# Altium schematic sheet stc15.SchDoc
size A4; SheetNumber: 1; SheetTotal: 1
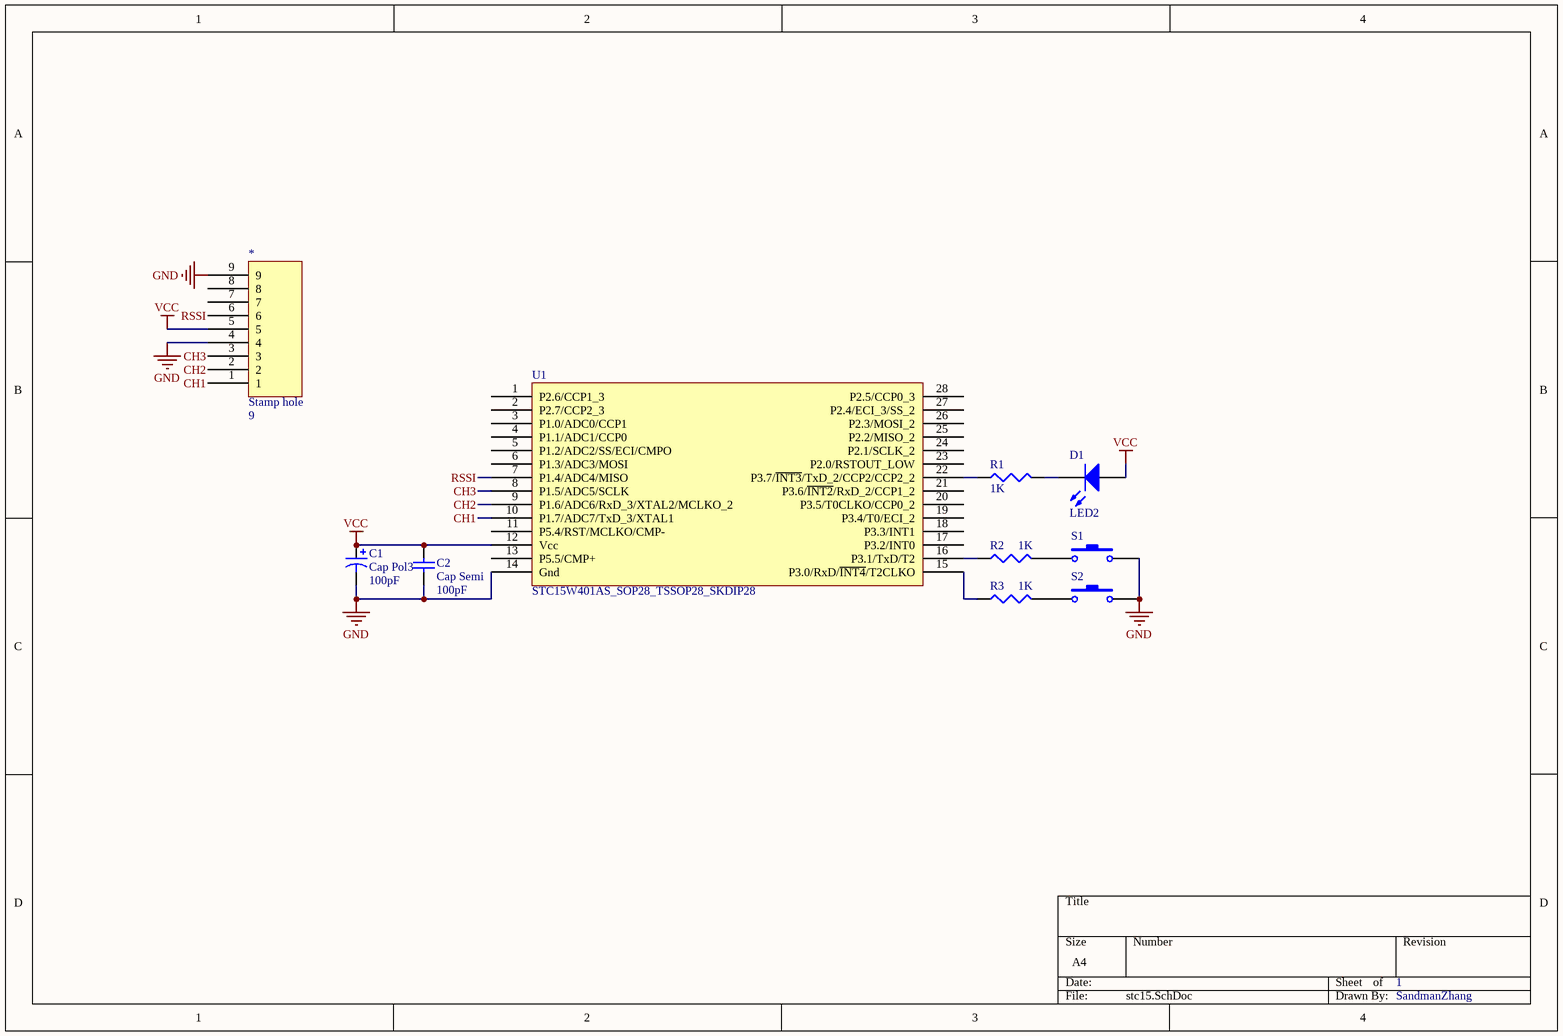
[diagram p0: stc15.SchDoc]

## Parts
*  9  [9]
C1  Cap Pol3  value 100pF  [C0805]
C2  Cap Semi  value 100pF  [1608[0603]]
D1  LED2  [6-0805_N]
R1  value 1K  [J1-0603]  (hidden comment: Res3)
R2  value 1K  [J1-0603]  (hidden comment: Res3)
R3  value 1K  [J1-0603]  (hidden comment: Res3)
S1  SW-PB  [SPST-2]  (value not drawn)
S2  SW-PB  [SPST-2]  (value not drawn)
U1  STC15W401AS_SOP28_TSSOP28_SKDIP28  [SOP28]

## Nets
GND: *.4 *.9 C1.2 C2.1 S1.2 S2.2 U1.14(Gnd)
VCC: *.5 C1.1 C2.2 D1.1(A) U1.12(Vcc)
CH1: *.1 U1.10(P1.7/ADC7/TxD_3/XTAL1)
CH2: *.2 U1.9(P1.6/ADC6/RxD_3/XTAL2/MCLKO_2)
CH3: *.3 U1.8(P1.5/ADC5/SCLK)
RSSI: *.6 U1.7(P1.4/ADC4/MISO)
NetD1_2: D1.2(K) R1.2
NetR1_1: R1.1 U1.22(P3.7/~{INT3}/TxD_2/CCP2/CCP2_2)
NetR2_1: R2.1 U1.16(P3.1/TxD/T2)
NetR2_2: R2.2 S1.1
NetR3_1: R3.1 U1.15(P3.0/RxD/~{INT4}/T2CLKO)
NetR3_2: R3.2 S2.1

Not connected (* = marked no-connect by the designer): * 7 8; U1 1(P2.6/CCP1_3) 2(P2.7/CCP2_3) 3(P1.0/ADC0/CCP1) 4(P1.1/ADC1/CCP0) 5(P1.2/ADC2/SS/ECI/CMPO) 6(P1.3/ADC3/MOSI) 11(P5.4/RST/MCLKO/CMP-) 13(P5.5/CMP+) 17(P3.2/INT0) 18(P3.3/INT1) 19(P3.4/T0/ECI_2) 20(P3.5/T0CLKO/CCP0_2) 21(P3.6/~{INT2}/RxD_2/CCP1_2) 23(P2.0/RSTOUT_LOW) 24(P2.1/SCLK_2) 25(P2.2/MISO_2) 26(P2.3/MOSI_2) 27(P2.4/ECI_3/SS_2) 28(P2.5/CCP0_3)

## Notes on the sheet
- 1
- SandmanZhang
- (in symbol 9) Stamp hole

## Library data of the parts
C1 = Cap Pol3: Polarized Capacitor (Surface Mount); Published: 8-Jun-2000; LatestRevisionDate: 29-May-2009; LatestRevisionNote: IPC-7351 Footprint Added.; PackageReference: C0805; Publisher: Altium Limited; PackageDescription: Chip Capacitor
C2 = Cap Semi: Capacitor (Semiconductor SIM Model); Published: 8-Jun-2000; LatestRevisionDate: 29-May-2009; LatestRevisionNote: IPC-7351 Footprint Added.; PackageReference: C1206; Publisher: Altium Limited; PackageDescription: Chip Capacitor
D1 = LED2: Typical RED, GREEN, YELLOW, AMBER GaAs LED; Published: 8-Jun-2000; LatestRevisionDate: 17-Jul-2002; LatestRevisionNote: Re-released for DXP Platform.; PackageVersion: Feb-2002; PackageReference: 3.2X1.6X1.1; Publisher: Altium Limited; PackageDescription: SM LED; 2 Flat Leads
R1-R3 = Res3: Resistor; Published: 8-Jun-2000; LatestRevisionDate: 29-May-2009; LatestRevisionNote: IPC-7351 Footprint Added.; PackageReference: J1-0603; Publisher: Altium Limited; PackageDescription: Chip Resistor
S1 S2 = SW-PB: Switch; Published: 24-Mar-1999; LatestRevisionDate: 17-Jul-2002; LatestRevisionNote: Re-released for DXP Platform.; PackageReference: SPST-2; Publisher: Altium Limited; PackageDescription: Switch; 2 Leads